# Altium schematic sheet Xds100v2Emu.SchDoc: XDS100V2简易版(带隔离)
size A3; Organization: Altium Limited; Address1: L3, 12a Rodborough Rd; Address2: Frenchs Forest; Address3: NSW; Address4: Australia 2086
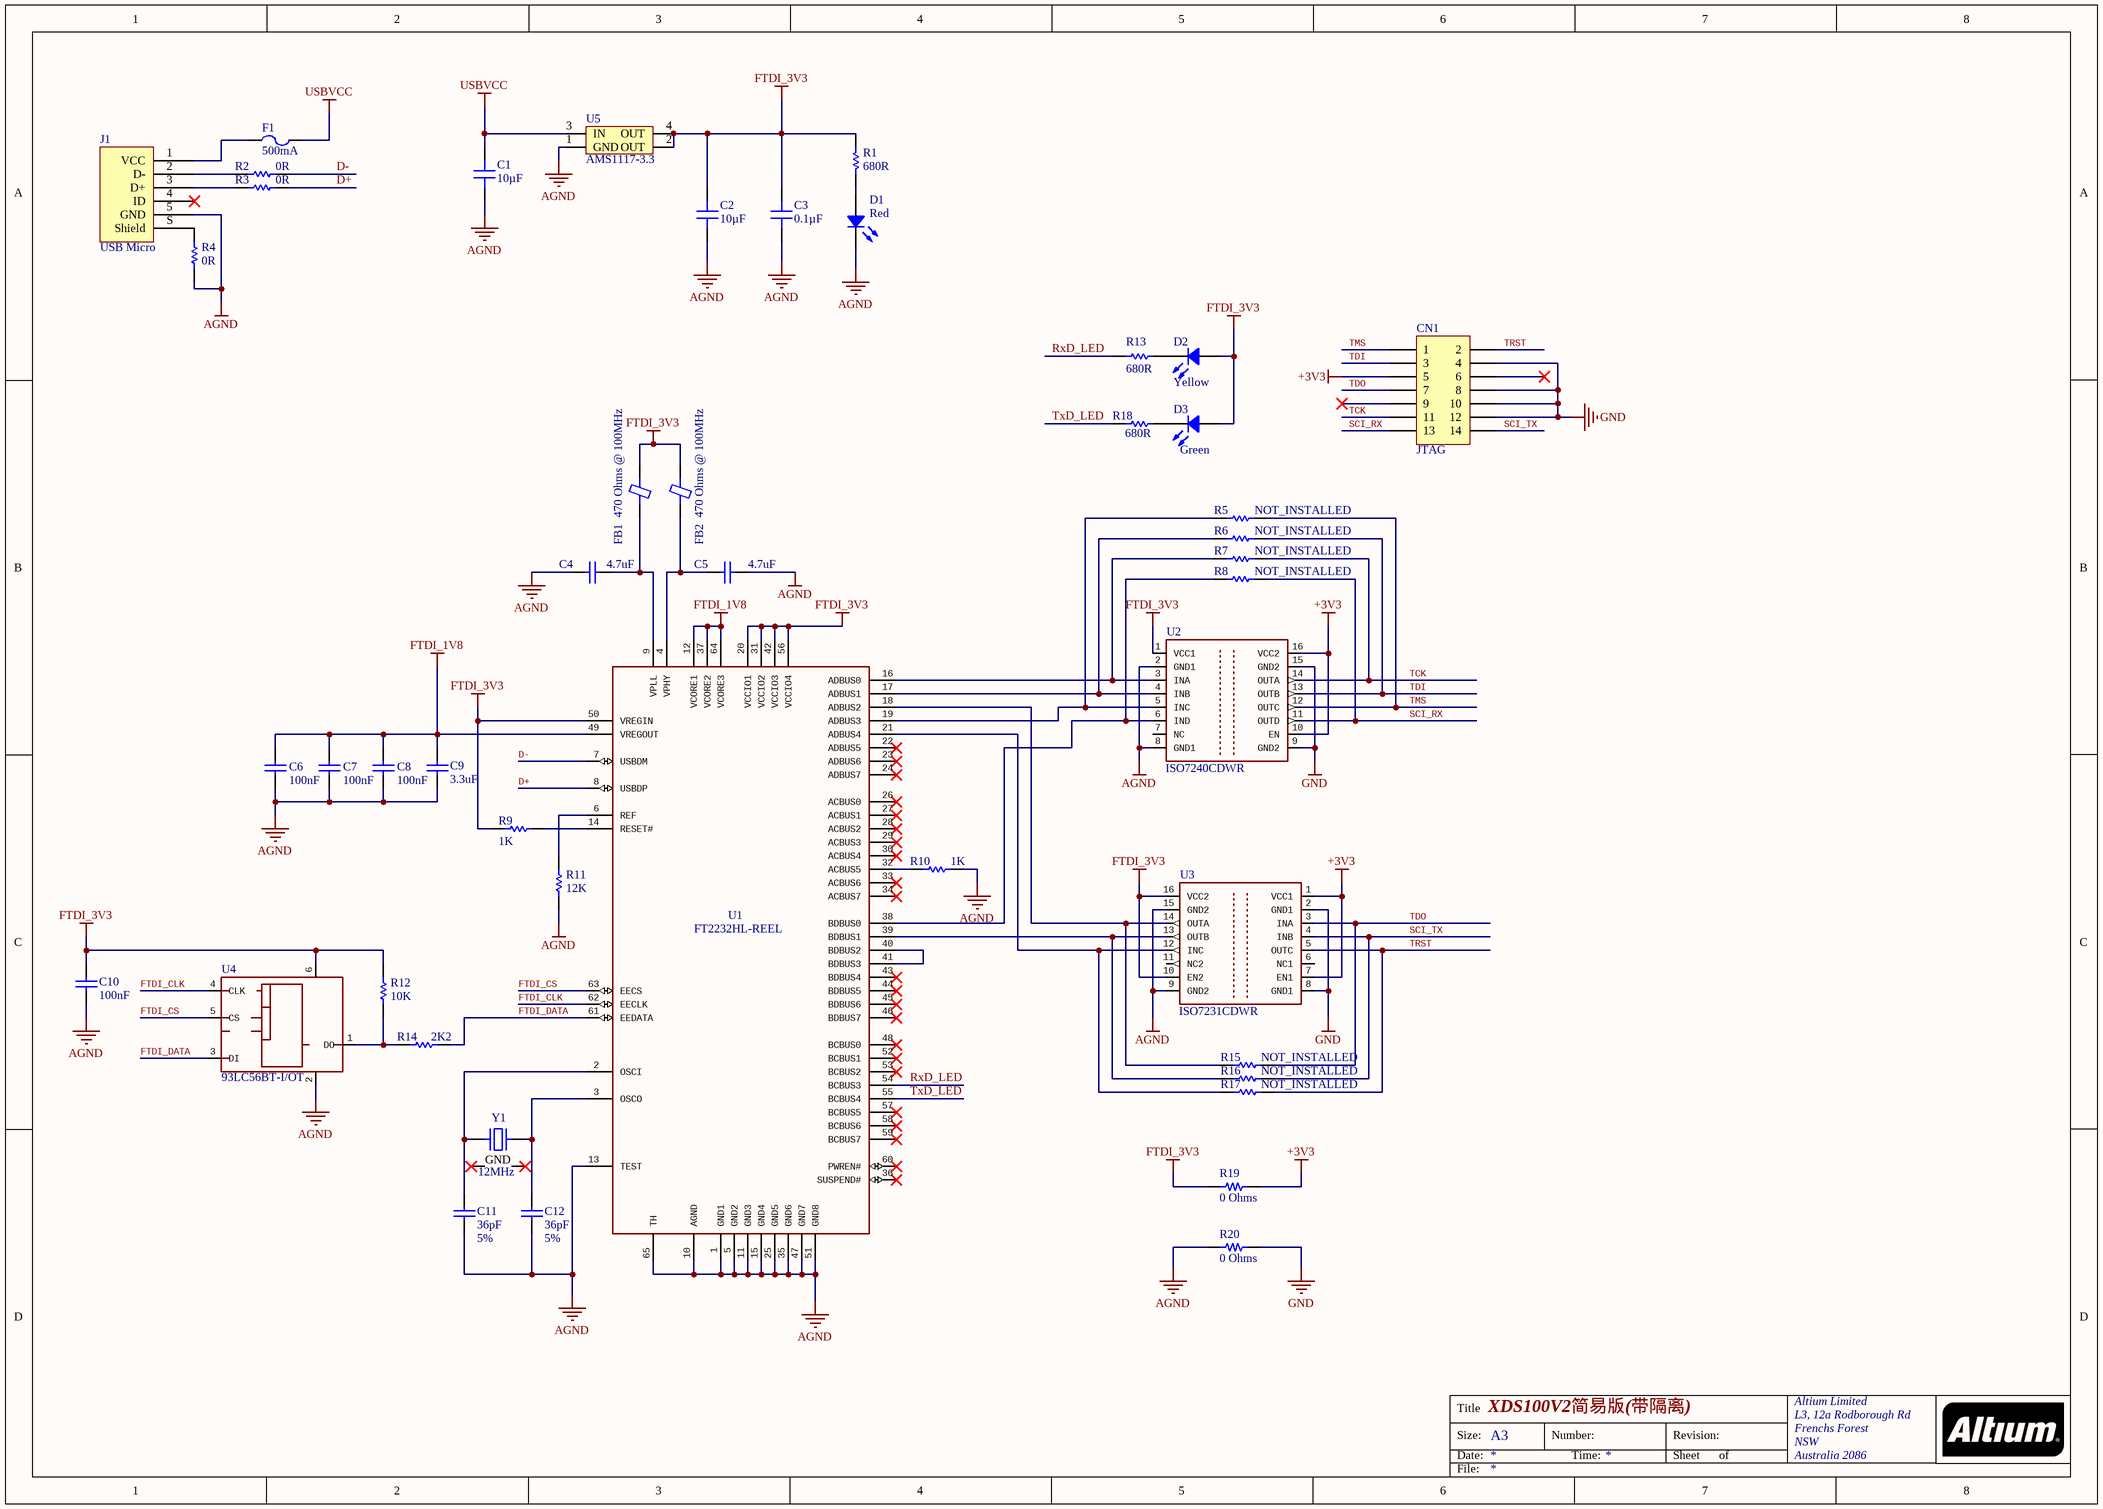
[diagram p0: Xds100v2Emu.SchDoc]

## Parts
C1  10µF  [CAP 0805_2012]
C2  10µF  [CAP 0805_2012]
C3  0.1µF  [CAP 0603_1608]
C4  4.7uF  [CAP 0603/1608]
C5  4.7uF  [CAP 0603/1608]
C6  100nF  [CAP 0603/1608]
C7  100nF  [CAP 0603/1608]
C8  100nF  [CAP 0603/1608]
C9  3.3uF  [CAP 0603/1608]
C10  100nF  [CAP 0603/1608]
C11  Rating: 5%  [CAP 0603/1608]  (hidden comment: 36pF)
C12  Rating: 5%  [CAP 0603/1608]  (hidden comment: 36pF)
CN1  JTAG  [JTAG调试接口]
D1  Red  [LED 0603_1608 RED]
D2  Yellow  [LED 0603_1608 YELLOW]
D3  Green  [LED 0603_1608 GREEN]
F1  value 500mA  [FUSM4632X85N]  (hidden comment: MF-MSMF050-2)
FB1  470 Ohms @ 100MHz  [FER 0603_1608]
FB2  470 Ohms @ 100MHz  [FER 0603_1608]
J1  USB Micro  [FCI USB 10118193-0001LF]
R1  680R  [RES 0603/1608]
R2  0R  [RES 0603/1608]
R3  0R  [RES 0603/1608]
R4  0R  [RES 0603/1608]
R5  NOT_INSTALLED  [RES 0603/1608]
R6  NOT_INSTALLED  [RES 0603/1608]
R7  NOT_INSTALLED  [RES 0603/1608]
R8  NOT_INSTALLED  [RES 0603/1608]
R9  1K  [RES 0603/1608]
R10  1K  [RES 0603/1608]
R11  12K  [RES 0603/1608]
R12  10K  [RES 0603/1608]
R13  680R  [RES 0603/1608]
R14  2K2  [RES 0603/1608]
R15  NOT_INSTALLED  [RES 0603/1608]
R16  NOT_INSTALLED  [RES 0603/1608]
R17  NOT_INSTALLED  [RES 0603/1608]
R18  680R  [RES 0603/1608]
R19  0 Ohms  [RES 0603_1608]
R20  0 Ohms  [RES 0603_1608]
U1  value FT2232HL-REEL  [LQFP64_N]  (hidden comment: FT2232HQ-REEL)
U2  ISO7240CDWR  [SOIC127P1030X265-16N]
U3  ISO7231CDWR  [SOIC127P1030X265-16N]
U4  93LC56BT-I/OT  [SOT23-6]
U5  AMS1117-3.3  [DIODES SOT-223]
Y1  value 12MHz  [NDK NX3225SA]  (hidden comment: NX3225SA-12MHZ-STD-CSR-6)

## Nets
+3V3: CN1.5 R19.2 U2.10(EN) U2.16(VCC2) U3.1(VCC1) U3.7(EN1)
AGND: C1.1 C2.1 C3.1 C4.1 C5.2 C6.1 C7.1 C8.1 C9.1 C10.1 C11.1 C12.1 D1.2 J1.5(GND) R4.1 R10.2 R11.1 R20.1 U1.1(GND1) U1.5(GND2) U1.10(AGND) U1.11(GND3) U1.13(TEST) U1.15(GND4) U1.25(GND5) U1.35(GND6) U1.47(GND7) U1.51(GND8) U1.65(TH) U2.2(GND1) U2.8(GND1) U3.9(GND2) U3.15(GND2) U4.2(GND) U5.1(GND)
FTDI_1V8: C6.2 C7.2 C8.2 C9.2 U1.12(VCORE1) U1.37(VCORE2) U1.49(VREGOUT) U1.64(VCORE3)
FTDI_3V3: C2.2 C3.2 C10.2 D2.1 D3.1 FB1.2 FB2.2 R1.2 R9.1 R12.1 R19.1 U1.20(VCCIO1) U1.31(VCCIO2) U1.42(VCCIO3) U1.50(VREGIN) U1.56(VCCIO4) U2.1(VCC1) U3.10(EN2) U3.16(VCC2) U4.6(VCC) U5.2(OUT) U5.4(OUT)
GND: CN1.4 CN1.8 CN1.10 CN1.12 R20.2 U2.9(GND2) U2.15(GND2) U3.2(GND1) U3.8(GND1)
USBVCC: C1.2 F1.2 U5.3(IN)
D+: R3.2 U1.8(USBDP)
D-: R2.2 U1.7(USBDM)
FTDI_CLK: U1.62(EECLK) U4.4(CLK)
FTDI_CS: U1.63(EECS) U4.5(CS)
FTDI_DATA: R14.2 U1.61(EEDATA) U4.3(DI)
RxD_LED: R13.1 U1.54(BCBUS3)
SCI_RX: CN1.13 R8.2 U2.11(OUTD)
SCI_TX: CN1.14 R16.2 U3.4(INB)
TCK: CN1.11 R7.2 U2.14(OUTA)
TDI: CN1.3 R6.2 U2.13(OUTB)
TDO: CN1.7 R15.2 U3.3(INA)
TMS: CN1.1 R5.2 U2.12(OUTC)
TRST: CN1.2 R17.2 U3.5(OUTC)
TxD_LED: R18.1 U1.55(BCBUS4)
NetC4_2: C4.2 FB1.1 U1.9(VPLL)
NetC5_1: C5.1 FB2.1 U1.4(VPHY)
NetC11_2: C11.2 U1.2(OSCI) Y1.1
NetC12_2: C12.2 U1.3(OSCO) Y1.3
NetD1_1: D1.1 R1.1
NetD2_2: D2.2 R13.2
NetD3_2: D3.2 R18.2
NetF1_1: F1.1 J1.1(VCC)
NetJ1_2: J1.2(D-) R2.1
NetJ1_3: J1.3(D+) R3.1
NetJ1_S: J1.S(Shield) R4.2
NetR5_1: R5.1 U1.19(ADBUS3) U2.5(INC)
NetR6_1: R6.1 U1.17(ADBUS1) U2.4(INB)
NetR7_1: R7.1 U1.16(ADBUS0) U2.3(INA)
NetR8_1: R8.1 U1.38(BDBUS0) U2.6(IND)
NetR9_2: R9.2 U1.14(RESET#)
NetR10_1: R10.1 U1.32(ACBUS5)
NetR11_2: R11.2 U1.6(REF)
NetR12_2: R12.2 R14.1 U4.1(DO)
NetR15_1: R15.1 U1.18(ADBUS2) U3.14(OUTA)
NetR16_1: R16.1 U1.39(BDBUS1) U3.13(OUTB)
NetR17_1: R17.1 U1.21(ADBUS4) U3.12(INC)
NetU1_40: U1.40(BDBUS2) U1.41(BDBUS3)

Not connected (* = marked no-connect by the designer): CN1 6* 9*; J1 4(ID)*; U1 22(ADBUS5)* 23(ADBUS6)* 24(ADBUS7)* 26(ACBUS0)* 27(ACBUS1)* 28(ACBUS2)* 29(ACBUS3)* 30(ACBUS4)* 33(ACBUS6)* 34(ACBUS7)* 36(SUSPEND#)* 43(BDBUS4)* 44(BDBUS5)* 45(BDBUS6)* 46(BDBUS7)* 48(BCBUS0)* 52(BCBUS1)* 53(BCBUS2)* 57(BCBUS5)* 58(BCBUS6)* 59(BCBUS7)* 60(PWREN#)*; U2 7(NC); U3 6(NC1) 11(NC2); Y1 2(GND)* 4(GND)*

## Notes on the sheet
- Title
- Size:
- Date:
- A3
- Number:
- Time:
- Revision:
- Sheet
- of
- File:

## Library data of the parts
C1 C2 = CL21B106KOQNNNG: CAP CER 10UF 16V X7R 0805; Manufacturer: Samsung Electro-Mechanics; Tolerance: ±10%; Part Number: CL21B106KOQNNNG; Value: 10µF; Applications: General Purpose; Capacitance: 10µF; ComponentLink1Description: Datasheet; ComponentLink1URL: http://www.samsungsem.com/kr/support/product-search/mlcc/CL21B106KOQNNNG.jsp; ComponentLink2Description: DigiKey Link; ComponentLink2URL: http://digikey.com/product-detail/en/samsung-electro-mechanics/CL21B106KOQNNNG/1276-6472-1-ND/5958100; Device Package: 0805 (2012 Metric); LastUpdated: 2020/1/21 0:02:49; Lifecycle Status: Active; Minimum Order: 1; Mounting Type: Surface Mount, MLCC; Operating Temperature: -55°C ~ 125°C; Package / Case: 0805 (2012 Metric); Packaging: TapeAndReel; PartId: 13168; Part Status: Active; Price: 0.06; Series: CL; Size / Dimension: 0.079" L x 0.049" W (2.00mm x 1.25mm); Supplier 1: DigiKey; Supplier Part Number 1: 1276-6472-1-ND; Temperature Coefficient: X7R; Thickness (Max): 0.055" (1.40mm); Voltage - Rated: 16V
C3 = GCJ188R71C104KA01D: CAP CER 0.1UF 16V X7R 0603; Manufacturer: Murata Electronics; Tolerance: ±10%; Part Number: GCJ188R71C104KA01D; Value: 0.1µF; Applications: Automotive, Boardflex Sensitive; Capacitance: 0.1µF; ComponentLink1Description: Datasheet; ComponentLink1URL: https://www.murata.com/~/media/webrenewal/support/library/catalog/products/capacitor/mlcc/c03e.ashx?la=en-us; ComponentLink2Description: DigiKey Link; ComponentLink2URL: http://digikey.com/product-detail/en/murata-electronics/GCJ188R71C104KA01D/490-5796-1-ND/2783830; Device Package: 0603 (1608 Metric); Features: Soft Termination; LastUpdated: 2020/1/21 0:01:37; Lifecycle Status: Active; Minimum Order: 1; Mounting Type: Surface Mount, MLCC; Operating Temperature: -55°C ~ 125°C; Package / Case: 0603 (1608 Metric); Packaging: TapeAndReel; PartId: 17928; Part Status: Active; Price: 0.05; Ratings: AEC-Q200; Series: GCJ; Size / Dimension: 0.063" L x 0.031" W (1.60mm x 0.80mm); Supplier 1: DigiKey; Supplier Part Number 1: 490-5796-1-ND; Temperature Coefficient: X7R; Thickness (Max): 0.035" (0.90mm); Voltage - Rated: 16V
C4 C5 = 1004001100218: CAP,4.7UF,+/-20%,X5R,6.3V,SMD0603; Manufacturer: KEMET; Manufacturer Part Number: C0603C475M8PACTU; Dielectric Material: Ceramic; Tolerance: 20%; Voltage Rating: 10V; Dissipation Factor: 5%; Supplier 1: Digi-Key; Supplier Part Number 1: 399-9100-1-ND; Stock 1: 160821; Pricing 1: 1 = 0.30000, 10 = 0.20900, 100 = 0.11830, 500 = 0.08350, 1000 = 0.07307 (USD); RoHS: Yes; Mount: Surface Mount; Case/Package: 0603; Number of Pins: 2; Case Code (Imperial): 0603; Case Code (Metric): 1608; Contact Plating: Tin,Matte; Min Operating Temperature: -55°C; Max Operating Temperature: 85°C; Capacitance: 4.7uF; Packaging: Tape and Reel; Voltage Rating (DC): 10V; Package Quantity: 1; Termination: SMD/SMT; Dielectric: X5R; Length: 1.6mm; Height: 0.8mm; Width: 0.8mm; Depth: 0.8mm; Thickness: 0.034inch; Lead Free: Lead Free; REACH SVHC: No SVHC; ComponentLink1URL: https://datasheet.ciiva.com/28614/1918694-28614758.pdf?src-supplier=Element14; ComponentLink1Description: https://datasheet.ciiva.com/28614/1918694-28614758.pdf?src-supplier=Element14
C6-C8 = 1004001100187: CAP,100NF(0.1uf),+/-10%,X5R,16V,SMD0603
C9 = 1004001100252: CAP,3.3uF,+/-10%,X5R,10V,SMD0603; Manufacturer: MURATA; Manufacturer Part Number: GRM188R61A335KE15D; Rating: 10%; Embest PN: 1004001100252; Value: 3.3uF; Part Type: Ceramic Capacitor
C10 = 1004001100187: CAP,100NF(0.1uf),+/-10%,X5R,10V,SMD0603; Manufacturer: MURATA; Manufacturer Part Number: GRM155R61A104KA01D; Rating: 10%; Embest PN: 1004001100187; Value: 100nF; Part Type: Ceramic Capacitor
C11 C12 = 1004001100255: CAP,36pF,+/-5%,C0G,50V,SMD0603; Manufacturer: MURATA; Manufacturer Part Number: GRM1555C1H360JA01D; Embest PN: 1004001100255; Value: 36pF; Part Type: Ceramic Capacitor
CN1 = Header 7X2: Header, 14-Pin; 封装形式: JTAG接口; A规格: 2.54mm，14p,双排; A封装形式: JTAG调试接口
D1 = SML-LXFM0603SIC-TR: LED RED CLEAR 0603 SMD; Manufacturer: Lumex Opto/Components Inc.; Configuration: Standard; Current - Test: 20mA; Lens Color: Colorless; Lens Size: 1.10mm x 0.80mm; Lens Style: Rectangle with Flat Top; Millicandela Rating: 150mcd; Viewing Angle: 120°; Voltage - Forward (Vf) (Typ): 2V; Wavelength - Peak: 636nm; Part Number: SML-LXFM0603SIC-TR; Color: Red; ComponentLink1Description: Datasheet; ComponentLink1URL: https://www.lumex.com/content/files/ProductAttachment/SML-LXFM0603SIC-TR.pdf; ComponentLink2Description: DigiKey Link; ComponentLink2URL: http://digikey.com/product-detail/en/lumex-opto-components-inc/SML-LXFM0603SIC-TR/67-2194-1-ND/4172841; Device Package: 0603 (1608 Metric); Height (Max): 1.10mm; LastUpdated: 2020/1/21 3:13:21; Lens Transparency: Clear; Lifecycle Status: Active; Minimum Order: 1; Mounting Type: Surface Mount; Package / Case: 0603 (1608 Metric); Packaging: TapeAndReel; PartId: 444; Part Status: Active; Price: 0.16; Series: -; Size / Dimension: 1.60mm L x 0.80mm W; Supplier 1: DigiKey; Supplier Part Number 1: 67-2194-1-ND; Supplier Device Package: 0603 (1608 Metric); Value: Red
D2 = SML-D12Y8WT86: LED YELLOW DIFFUSED 0603 SMD; Manufacturer: Rohm Semiconductor; Configuration: Standard; Current - Test: 20mA; Lens Color: White; Lens Size: 1.20mm x 0.80mm; Lens Style: Rectangle with Flat Top; Millicandela Rating: 63mcd; Voltage - Forward (Vf) (Typ): 2.2V; Wavelength - Dominant: 590nm; Part Number: SML-D12Y8WT86; Color: Yellow; ComponentLink1Description: Datasheet; ComponentLink1URL: https://www.rohm.com/datasheet/SML-D12V8W; ComponentLink2Description: DigiKey Link; ComponentLink2URL: http://digikey.com/product-detail/en/rohm-semiconductor/SML-D12Y8WT86/511-1582-1-ND/1641814; Device Package: 0603 (1608 Metric); Height (Max): 0.65mm; LastUpdated: 2020/1/21 3:15:04; Lens Transparency: Diffused; Lifecycle Status: Active; Minimum Order: 1; Mounting Type: Surface Mount; Package / Case: 0603 (1608 Metric); Packaging: TapeAndReel; PartId: 110; Part Status: Active; Price: 0.06; Series: EXCELED™; Size / Dimension: 1.60mm L x 0.80mm W; Supplier 1: DigiKey; Supplier Part Number 1: 511-1582-1-ND; Supplier Device Package: 0603 (1608 Metric); Value: Yellow
D3 = SML-D13FWT86: LED GREEN DIFFUSED 0603 SMD; Manufacturer: Rohm Semiconductor; Configuration: Standard; Current - Test: 20mA; Lens Color: White; Lens Size: 1.20mm x 0.80mm; Lens Style: Rectangle with Flat Top; Millicandela Rating: 22mcd; Voltage - Forward (Vf) (Typ): 2.1V; Wavelength - Dominant: 564nm; Part Number: SML-D13FWT86; Color: Green; ComponentLink1Description: Datasheet; ComponentLink1URL: //media.digikey.com/pdf/Data%20Sheets/Rohm%20PDFs/SML-D13(A)%20Series.pdf; ComponentLink2Description: DigiKey Link; ComponentLink2URL: http://digikey.com/product-detail/en/rohm-semiconductor/SML-D13FWT86/SML-D13FWT86CT-ND/9952108; Device Package: 0603 (1608 Metric); Height (Max): 0.65mm; LastUpdated: 2020/1/21 3:12:14; Lens Transparency: Diffused; Lifecycle Status: Active; Minimum Order: 1; Mounting Type: Surface Mount; Package / Case: 0603 (1608 Metric); Packaging: TapeAndReel; PartId: 591; Part Status: Active; Price: 0.12; Series: SML-D13 (A); Size / Dimension: 1.60mm L x 0.80mm W; Supplier 1: DigiKey; Supplier Part Number 1: SML-D13FWT86CT-ND; Supplier Device Package: 0603 (1608 Metric); Value: Green
F1 = 1007001100029: PTC RESETTABLE .50A 15V 1812; Manufacturer: BOURNS; Embest PN: 1007001100029; Part Type: Polyswitch; Manufacturer Part Number: MF-MSMF050-2
FB1 FB2 = BLM18BB471SN1D: FERRITE BEAD 470 OHM 0603 1LN; Manufacturer: Murata Electronics; Current Rating (Max): 300mA; DC Resistance (DCR) (Max): 850mOhm; Filter Type: Signal Line; Number of Lines: 1; Part Number: BLM18BB471SN1D; ComponentLink1Description: Datasheet; ComponentLink1URL: https://www.murata.com/en-us/products/productdata/8796738650142/ENFA0003.pdf; ComponentLink2Description: DigiKey Link; ComponentLink2URL: http://digikey.com/product-detail/en/murata-electronics/BLM18BB471SN1D/490-1021-1-ND/584469; Device Package: 0603 (1608 Metric); Height (Max): 0.037" (0.95mm); Impedance @ Frequency: 470 Ohms @ 100MHz; LastUpdated: 2020/1/21 2:28:20; Lifecycle Status: Active; Minimum Order: 1; Mounting Type: Surface Mount; Operating Temperature: -55°C ~ 125°C; Package / Case: 0603 (1608 Metric); Packaging: TapeAndReel; PartId: 596; Part Status: Active; Price: 0.02; Series: EMIFIL®, BLM18; Size / Dimension: 0.063" L x 0.032" W (1.60mm x 0.80mm); Supplier 1: DigiKey; Supplier Part Number 1: 490-1021-1-ND; Value: 470 Ohms @ 100MHz
J1 = USB 2.0 Type B Micro
R1 R13 = 1003001100490: RES,680R,+/-5%,1/10W,SMD0603
R2-R4 = 1003001100001: RES,0R,+/-5%,1/10W,SMD0603
R5-R8 R15-R17 = 1003001100325: RES,0R,+/-5%,1/10W,SMD0603
R9 = 1003001100034: RES,1K,+/-5%,1/10W,SMD0603
R10 = 1003001100034: RES,1K,+/-1%,1/10W,SMD0603
R11 = 1003001100075: RES,12K,+/-1%,1/10W,SMD0603
R12 = 1003001100071: RES,10K,+/-1%,1/10W,SMD0603
R14 = 1003001100045: RES,2K2,+/-1%,1/10W,SMD0603
R18 = 1003001100490: RES,680R,+/-1%,1/10W,SMD0603
R19 R20 = SFR03EZPJ000: RES 0 OHM JUMPER 1/10W 0603; Manufacturer: Rohm Semiconductor; Power (Watts): 0.1W, 1/10W; Part Number: SFR03EZPJ000; Value: 0 Ohms; ComponentLink1Description: Datasheet; ComponentLink1URL: https://www.rohm.com/datasheet/SFR03EZPJ/sfr-e; ComponentLink2Description: DigiKey Link; ComponentLink2URL: http://digikey.com/product-detail/en/rohm-semiconductor/SFR03EZPJ000/511-1823-1-ND/9771887; Composition: Thick Film; Device Package: 0603 (1608 Metric); Features: Anti-Sulfur; Height - Seated (Max): 0.022" (0.55mm); LastUpdated: 2020/1/21 0:22:48; Lifecycle Status: Active; Minimum Order: 1; Number of Terminations: 2; Operating Temperature: -55°C ~ 155°C; Package / Case: 0603 (1608 Metric); Packaging: TapeAndReel; PartId: 10194; Part Status: Active; Price: 0.01; Resistance: 0 Ohms; Series: SFR; Size / Dimension: 0.063" L x 0.031" W (1.60mm x 0.80mm); Supplier 1: DigiKey; Supplier Part Number 1: 511-1823-1-ND; Supplier Device Package: 603; Tolerance: Jumper
U1 = 1002010100084: IC,Dual High Speed USB to Multipurpose UART/FIFO IC,FT2232HL-REEL,LQFP-64,SMD; Manufacturer: FTDI; Embest PN: 1002010100084; Part Type: Interface; Manufacturer Part Number: FT2232HL-REEL
U2 = 1002017100004C: IC DGTL ISO 4CH CMOS 16SOIC,CUSTOMER SUPPLY; Manufacturer: TI; Embest PN: 1002017100004C; Value: ISO7240CDWR; Part Type: Isolator; Manufacturer Part Number: ISO7240CDWR
U3 = 1002017100003C: IC DGTL ISO 3CH CMOS 16SOIC,CUSTOMER SUPPLY; Manufacturer: TI; Embest PN: 1002017100003C; Value: ISO7231CDWR; Part Type: Isolator; Manufacturer Part Number: ISO7231CDWR
U4 = 1002003100163: IC,EEPROM Serial-Microwire 2K-Bit 128 x 16 2MHz,93LC56BT-I/OT,SOT-23-6,SMD; Manufacturer: MICROCHIP; Embest PN: 1002003100163; Value: 93LC56BT-I/OT; Part Type: Memory; Manufacturer Part Number: 93LC56BT-I/OT
U5 = AMS1117: 电源转换5Vto3.3V
Y1 = NX3225SA-12MHZ-STD-CSR-6: CRYSTAL 12.0000MHZ 8PF SMD; Manufacturer: NDK America, Inc.; ESR (Equivalent Series Resistance): 100 Ohms; Frequency Stability: ±25ppm; Frequency Tolerance: ±15ppm; Operating Mode: Fundamental; Part Number: NX3225SA-12MHZ-STD-CSR-6; ComponentLink1Description: Datasheet; ComponentLink1URL: http://www.ndk.com/images/products/catalog/c_NX3225SA_e.pdf; ComponentLink2Description: DigiKey Link; ComponentLink2URL: http://digikey.com/product-detail/en/ndk-america-inc/NX3225SA-12MHZ-STD-CSR-6/644-1180-1-ND/3125569; Device Package: 4-SMD, No Lead; Frequency: 12MHz; Height - Seated (Max): 0.024" (0.60mm); LastUpdated: 2020/1/21 3:23:16; Lifecycle Status: Active; Load Capacitance: 8pF; Minimum Order: 1; Mounting Type: Surface Mount; Operating Temperature: -40°C ~ 85°C; Package / Case: 4-SMD, No Lead; Packaging: TapeAndReel; PartId: 590; Part Status: Active; Price: 0.45; Series: NX3225SA; Size / Dimension: 0.126" L x 0.098" W (3.20mm x 2.50mm); Supplier 1: DigiKey; Supplier Part Number 1: 644-1180-1-ND; Type: MHz Crystal